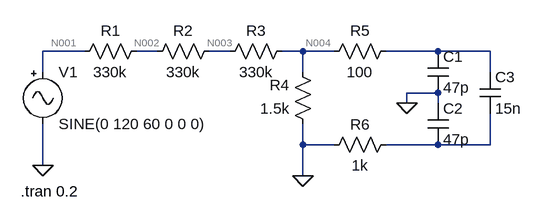
[diagram p0: schematic Voltage_Shunt_Simulation.asc]
Voltage_Shunt_Simulation.asc, the LTspice schematic file:
Version 4
SHEET 1 880 680
WIRE -32 48 -96 48
WIRE 80 48 48 48
WIRE 192 48 160 48
WIRE 304 48 272 48
WIRE 352 48 304 48
WIRE 512 48 432 48
WIRE 592 48 512 48
WIRE -96 80 -96 48
WIRE 304 80 304 48
WIRE 592 80 592 48
WIRE 512 112 464 112
WIRE 464 128 464 112
WIRE 512 128 512 112
WIRE 304 192 304 160
WIRE 352 192 304 192
WIRE 512 192 432 192
WIRE 592 192 592 144
WIRE 592 192 512 192
WIRE -96 224 -96 160
WIRE 304 240 304 192
FLAG 464 128 0
FLAG 304 240 0
FLAG -96 224 0
SYMBOL res 64 32 R90
WINDOW 0 0 56 VBottom 0
WINDOW 3 32 56 VTop 0
SYMATTR InstName R1
SYMATTR Value 330k
SYMBOL res 176 32 R90
WINDOW 0 0 56 VBottom 0
WINDOW 3 32 56 VTop 0
SYMATTR InstName R2
SYMATTR Value 330k
SYMBOL res 288 32 R90
WINDOW 0 0 56 VBottom 0
WINDOW 3 32 56 VTop 0
SYMATTR InstName R3
SYMATTR Value 330k
SYMBOL res 320 176 R180
WINDOW 0 36 76 Left 0
WINDOW 3 36 40 Left 0
SYMATTR InstName R4
SYMATTR Value 1.5k
SYMBOL res 336 64 R270
WINDOW 0 32 56 VTop 0
WINDOW 3 0 56 VBottom 0
SYMATTR InstName R5
SYMATTR Value 100
SYMBOL res 448 176 R90
WINDOW 0 0 56 VBottom 0
WINDOW 3 32 56 VTop 0
SYMATTR InstName R6
SYMATTR Value 1k
SYMBOL cap 496 48 R0
SYMATTR InstName C1
SYMATTR Value 47p
SYMBOL cap 496 128 R0
SYMATTR InstName C2
SYMATTR Value 47p
SYMBOL cap 576 80 R0
SYMATTR InstName C3
SYMATTR Value 15n
SYMBOL Misc\\signal -96 64 R0
WINDOW 123 0 0 Left 0
WINDOW 39 0 0 Left 0
SYMATTR InstName V1
SYMATTR Value SINE(0 120 60 0 0 0)
TEXT -130 264 Left 0 !.tran 0.2

The netlist it stands for:
* Voltage_Shunt_Simulation.asc
R1 N002 N001 330k
R2 N003 N002 330k
R3 N004 N003 330k
R4 0 N004 1.5k
R5 N004 N005 100
R6 N006 0 1k
C1 N005 0 47p
C2 0 N006 47p
C3 N005 N006 15n
V1 N001 0 SINE(0 120 60 0 0 0)
.tran 0.2
.backanno
.end

* Results of the author's LTspice run, read from the files saved beside the schematic
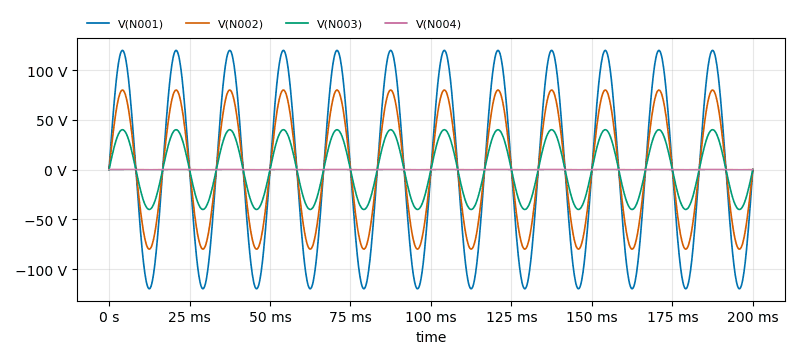
[diagram p1: Transient Analysis of Voltage_Shunt_Simulation.asc, plotted from the saved traces]
* Transient Analysis, 1 run:
*   V(N001): min -119.8 V, max 119.8 V, average 23.98 µV, rms 84.74 V, last 0 V
*   V(N002): min -79.95 V, max 79.95 V, average 16.11 µV, rms 56.53 V, last -514.2 µV
*   V(N003): min -40.07 V, max 40.07 V, average 8.234 µV, rms 28.33 V, last -1.028 mV
*   V(N004): min -181.3 mV, max 181.3 mV, average 346.5 nV, rms 128.2 mV, last -1.543 mV